# EAGLE schematic jack-o-lantern_schematic (EAGLE 7.3.0)
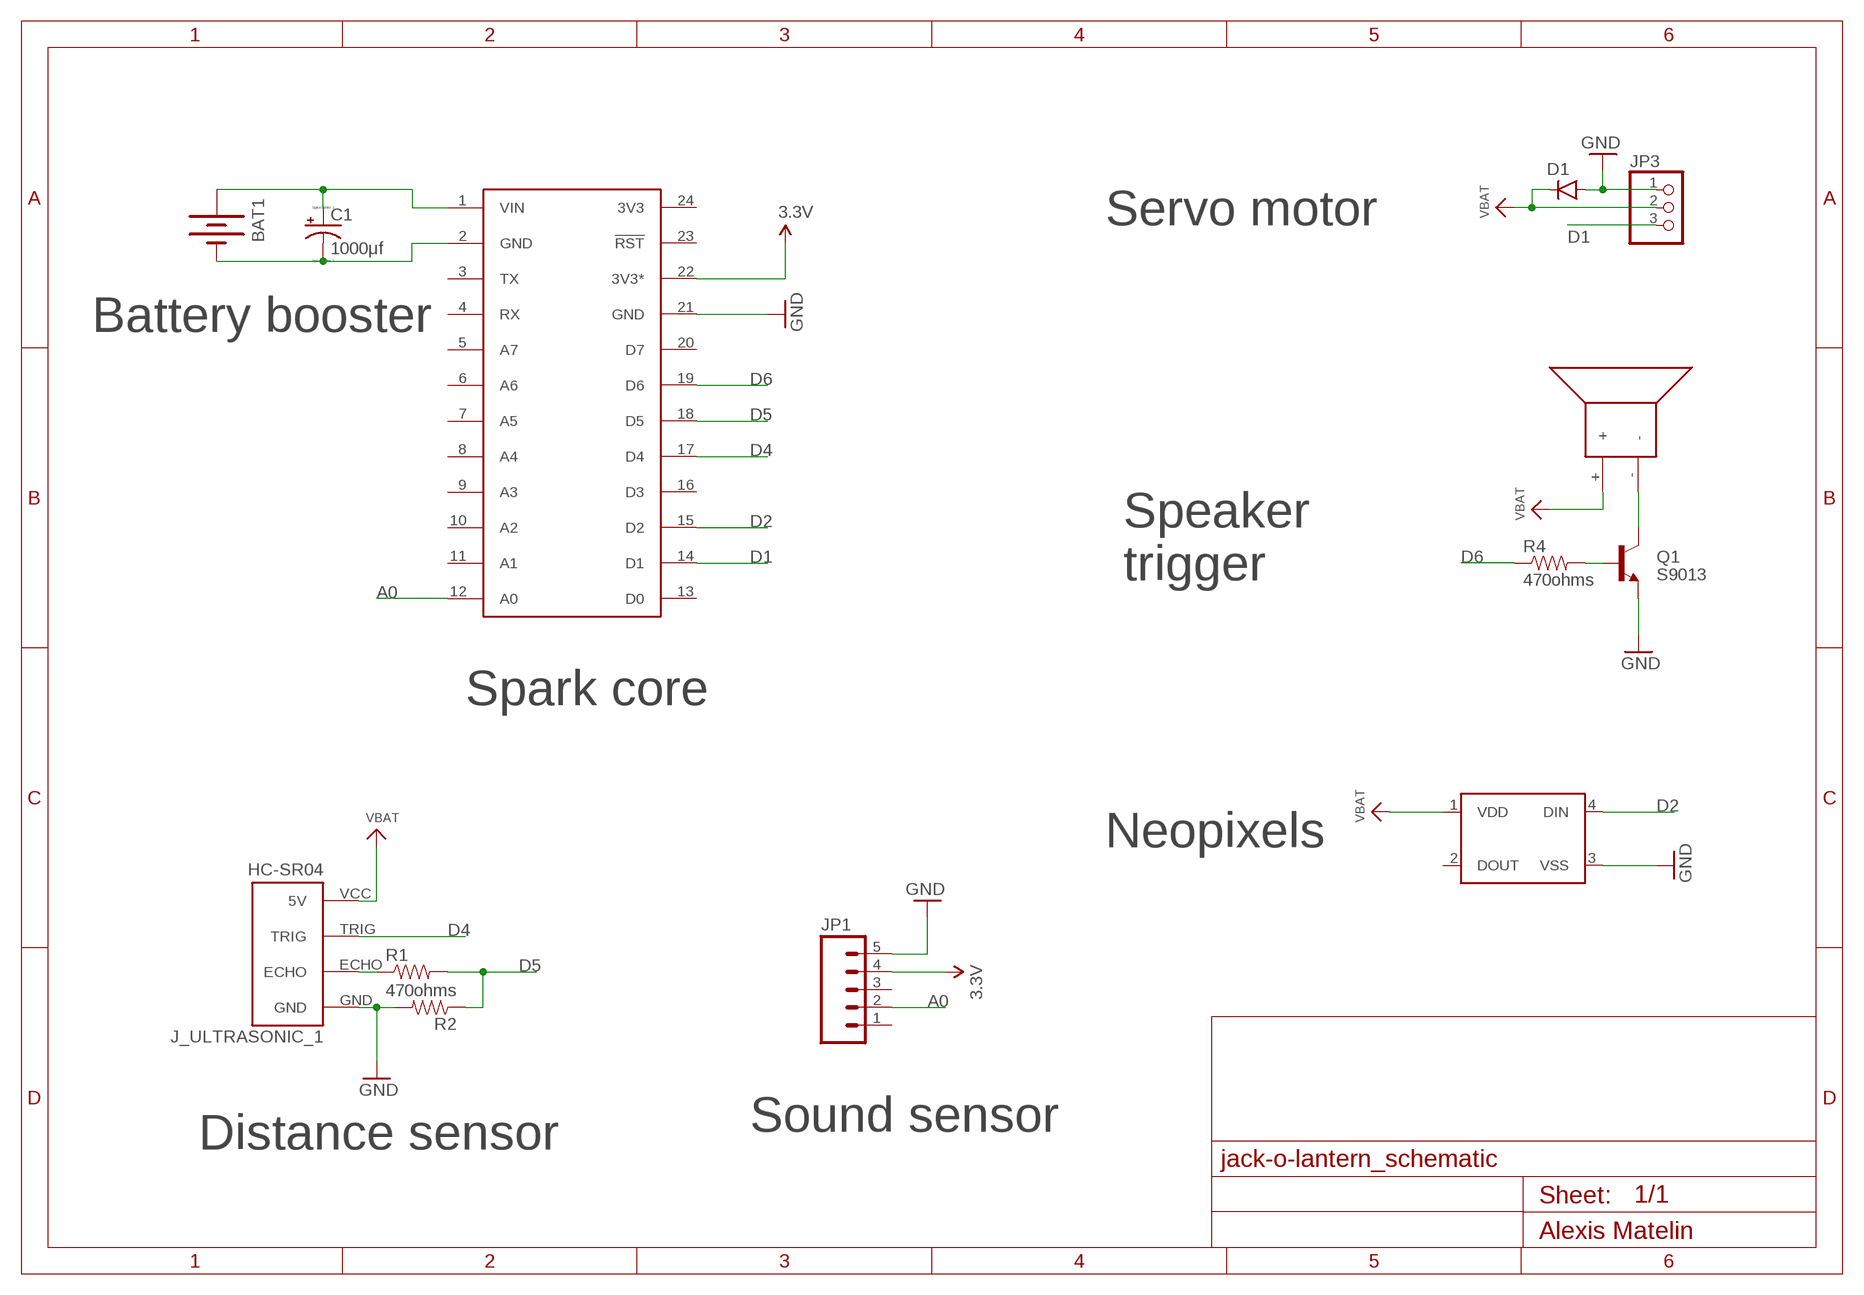
[diagram p0: schematic, sheet 1]

## Parts
BAT1  BATTERYLIPO-TABS  [LIPO-110-TABS]
C1  1000μf  CPOL-USE2-4  [E2-4]
D1  DIODEPTH  [DIODE-1N4001]
D3  WS2812B  [WS2812B]
J_ULTRASONIC_1  HC-SR04  [HC-SR04_FOOTPRINT]
JP1  M05PTH  [1X05]
JP3  PINHD-1X3  [1X03]
Q1  S9013  TRANSISTOR_NPNBC547  [TO-92-AMMO]
R1  RESISTORAXIAL-0.3  [AXIAL-0.3]
R2  470ohms  RESISTORAXIAL-0.3  [AXIAL-0.3]
R4  470ohms  RESISTORAXIAL-0.3  [AXIAL-0.3]
SP2  SPEAKERPCB_MOUNT  [PCB_MOUNT_SPEAKER]
U$1  SPARK_CORECORE  [SPARK_CORE]

## Nets
3.3V: JP1.4 U$1.22(3V3*)
A0: JP1.2 U$1.12(A0)
D1: JP3.3 U$1.14(D1)
D2: D3.4(DIN) U$1.15(D2)
D4: J_ULTRASONIC_1.TRIG U$1.17(D4)
D5: R1.P$2 R2.P$1 U$1.18(D5)
D6: R4.P$1 U$1.19(D6)
GND: D1.A D3.3(VSS) J_ULTRASONIC_1.GND JP1.5 JP3.1 Q1.3(E) R2.P$2 U$1.21(GND)
N$1: J_ULTRASONIC_1.ECHO R1.P$1
N$2: BAT1.- C1.- U$1.2(GND)
N$3: BAT1.+ C1.+ U$1.1(VIN)
N$4: Q1.1(C) SP2.-
N$6: Q1.2(B) R4.P$2
VBAT: D1.C D3.1(VDD) J_ULTRASONIC_1.VCC(5V) JP3.2 SP2.+
Unconnected: D3.2(DOUT) JP1.1 JP1.3 U$1.3(TX) U$1.4(RX) U$1.5(A7) U$1.6(A6) U$1.7(A5) U$1.8(A4) U$1.9(A3) U$1.10(A2) U$1.11(A1) U$1.13(D0) U$1.16(D3) U$1.20(D7) U$1.23(!RST)

## Notes on the sheet
- Servo motor
- Battery booster
- Speaker
  trigger
- Spark core
- Neopixels
- Sound sensor
- Distance sensor

## Power pins joined to a net without a drawn wire
3V3: U$1.24(3V3)

## Library data of the parts
BAT1 = SparkFun-Electromechanical:BATTERY: Battery Holders Various common sizes : AA, AAA, 18650 (PRT-12895), 20mm coin cell and 12mm coin cell. 20MM_4LEGS, BATT-10373
C1 = resistor:CPOL-US: POLARIZED CAPACITOR, American symbol
D1 = SparkFun-DiscreteSemi:DIODE: Diode These are standard reverse protection diodes and small signal diodes. SMA package can handle up to about 1A. SOD-323 can handle about 200mA. What the SOD-323 package when ordering, there are some mfgs out there that are 5-pin packages.
D3 = SparkFun-LED:WS2812B: WS2812B - Intelligent control LED integrated light source Technical Specifications: Power Supply Voltage (VDD): 3.5 to 5.3 V Input Voltage (VI): -0.5 to VDD+0.5 V Operating Junction Temperature (Topt): -25°C to +80°C Storage Temperature Range (Tstg): -55°C to +150°C; PROD_ID: DIO-12503
J_ULTRASONIC_1 = Ultrasonic Sensor HC-SR04:HC-SR04: Ultrasonic Sensor HC-SR04
JP1 = SparkFun-Connectors:M05: Header 5 Standard 5-pin 0.1" header. Use with straight break away headers (SKU : PRT-00116), right angle break away headers (PRT-00553), swiss pins (PRT-00743), machine pins (PRT-00117), and female headers (PRT-00115). Molex polarized connector foot print use with SKU : PRT-08230 with associated crimp pins and housings.
JP3 = adafruit:PINHD-1X3: PIN HEADER
Q1 = SparkFun-DiscreteSemi:TRANSISTOR_NPN: Generic NPN BJT MMBT2222A - TRANS-08049 (SOT-23, 1A 40V) MPSA42 - TRANS-09116 (SOT-23, 500mA 300V) MMBT5088LT1G - TRANS-11160 (SOT-23, 50 mA 30V) BC547 - COM-08928 <http://www.sparkfun.com/products/8928> (TO-92 45V 100mA) (1.Collector 2.Base 3.Emitter) 2N3904 - COM-00521 <http://www.sparkfun.com/products/521> (TO-92 40V 200mA) (1.Emitter 2.Base 3.Collector) P2N2222A - COM-12852 <http://www.sparkfun.com/products/12852> (TO-92 40V 600mA) (1.Collector 2.Base 3.Emitter)
R1 R2 R4 = SparkFun-Passives:RESISTOR: Resistor Basic schematic elements and footprints for 0603, 1206, and PTH resistors.
SP2 = SparkFun-Electromechanical:SPEAKER: General speakers.; MFG: SANCO; PROD_#: NA; SKU: COM-11089; SPARKLE_ID: 6504
U$1 = Spark:SPARK_CORE